# Altium schematic sheet power.SchDoc
size A4; SheetNumber: 2; SheetTotal: 2
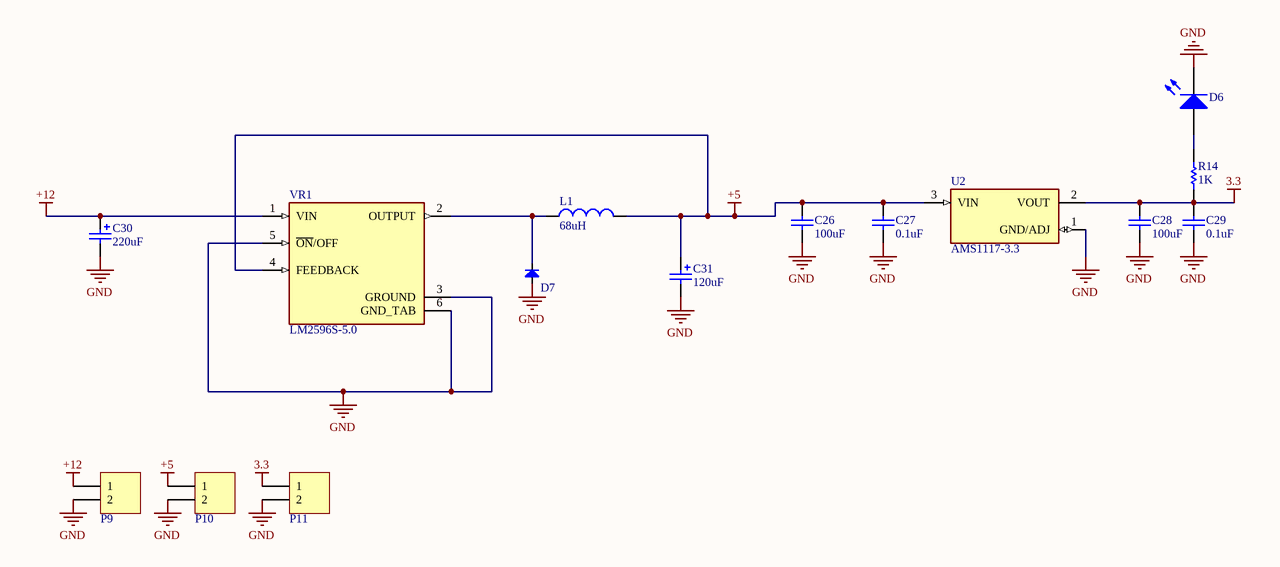
[diagram p0: power.SchDoc]

## Parts
C26  value 100uF  [CAP-SM-0603]  (hidden comment: Cap Non-Pol SMD)
C27  value 0.1uF  [CAP-SM-0603]  (hidden comment: Cap Non-Pol SMD)
C28  value 100uF  [CAP-SM-0603]  (hidden comment: Cap Non-Pol SMD)
C29  value 0.1uF  [CAP-SM-0603]  (hidden comment: Cap Non-Pol SMD)
C30  value 220uF  [CP1.5/3.4]  (hidden comment: Cap Pol)
C31  value 120uF  [CP1.5/3.4]  (hidden comment: Cap Pol)
D6  LED SMD  [LED_0603_Blue]  (value not drawn)
D7  Diode  [DIO-1A]  (value not drawn)
L1  value 68uH  [INDUCTOR 12.5x12.5]  (hidden comment: Inductor)
P9  Domino 2  [DOMINO 2- 5mm]  (value not drawn)
P10  Header 2  [JP2]  (value not drawn)
P11  Header 2  [JP2]  (value not drawn)
R14  value 1K  [RES-SM-0603]  (hidden comment: RESISTOR SMD)
U2  AMS1117-3.3  [SOT229P700X180-4N]
VR1  LM2596S-5.0  [TO170P1524X483-6N]

## Nets
3.3: C28.2 C29.1 P11.1 R14.2 U2.2(VOUT)
+5: C26.2 C27.2 C31.1 L1.2 P10.1 U2.3(VIN) VR1.4(FEEDBACK)
+12: C30.1 P9.1 VR1.1(VIN)
GND: C26.1 C27.1 C28.1 C29.2 C30.2 C31.2 D6.2(K) D7.1(A) P9.2 P10.2 P11.2 U2.1(GND/ADJ) VR1.3(GROUND) VR1.5(~{ON}/OFF) VR1.6(GND_TAB)
NetD6_1: D6.1(A) R14.1
NetD7_2: D7.2(K) L1.1 VR1.2(OUTPUT)

## Library data of the parts
C26-C29 = Cap Non-Pol SMD: Capacitor
C30 C31 = Cap Pol: Polarized Capacitor (Radial)
D6 = LED SMD: LED
D7 = Diode: Default Diode; Code - JEDEC: DO-214-AB; Value: 1N5007; Published: 8-Jun-2000; Revision: July-2002: Re-released for DXP Platform.; Publisher: Altium Limited
P9 = Domino 2: Domino, 2-Pin; LatestRevisionDate: 17-Jul-2002; LatestRevisionNote: Re-released for DXP Platform.; Publisher: Altium Limited
P10 P11 = Header 2: Header, 2-Pin; LatestRevisionDate: 17-Jul-2002; LatestRevisionNote: Re-released for DXP Platform.; Publisher: Altium Limited
R14 = RESISTOR SMD: Resistor
U2 = AMS1117-3.3: Sot223/Pkg 1-Amp 3.3-Volt Low Drop Out Voltage Regulatator; MF: Advanced Monolithic Systems; Package: SOT-223 Seeed Technology; Value: *; Check_prices: https://www.snapeda.com/parts/AMS1117-3.3/Advanced+Monolithic+Systems/view-part/?ref=eda; Price: None; Availability: Not in stock; MP: AMS1117-3.3; SnapEDA_Link: https://www.snapeda.com/parts/AMS1117-3.3/Advanced+Monolithic+Systems/view-part/?ref=snap
VR1 = LM2596S-5.0: SIMPLE SWITCHER&reg; 4.5V to 40V, 3A Low Component Count Step-Down Regulator; MP: LM2596S-5.0/NOPB; MF: Texas Instruments; Price: None; Availability: In Stock; Package: TO-263-5 Texas Instruments; SnapEDA_Link: https://www.snapeda.com/parts/LM2596S-5.0/NOPB/Texas+Instruments/view-part/?ref=snap; Check_prices: https://www.snapeda.com/parts/LM2596S-5.0/NOPB/Texas+Instruments/view-part/?ref=eda; Value: *; Purchase-URL: https://pricing.snapeda.com/search/part/LM2596S-5.0/NOPB/?ref=eda